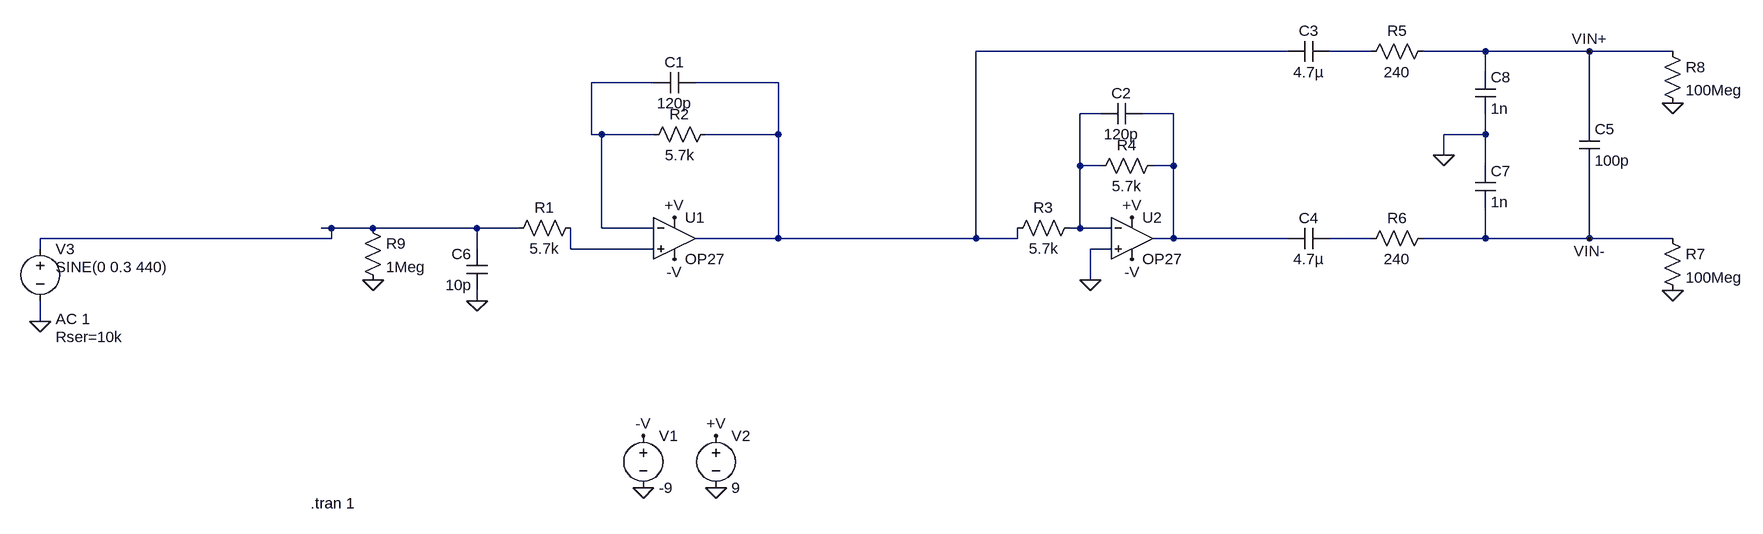
[diagram p0: schematic Draft1.asc]
Draft1.asc, the LTspice schematic file:
Version 4
SHEET 1 2212 920
WIRE 1504 208 1024 208
WIRE 1632 208 1568 208
WIRE 1808 208 1712 208
WIRE 1968 208 1808 208
WIRE 2096 208 1968 208
WIRE 1808 240 1808 208
WIRE 528 256 432 256
WIRE 720 256 592 256
WIRE 1216 304 1184 304
WIRE 1328 304 1280 304
WIRE 1968 320 1968 208
WIRE 432 336 432 256
WIRE 448 336 432 336
WIRE 528 336 448 336
WIRE 720 336 720 256
WIRE 720 336 608 336
WIRE 1808 336 1808 304
WIRE 1808 336 1744 336
WIRE 1744 368 1744 336
WIRE 1184 384 1184 304
WIRE 1216 384 1184 384
WIRE 1328 384 1328 304
WIRE 1328 384 1296 384
WIRE 1808 384 1808 336
WIRE 32 480 16 480
WIRE 96 480 32 480
WIRE 256 480 96 480
WIRE 320 480 256 480
WIRE 448 480 448 336
WIRE 528 480 448 480
WIRE 1184 480 1184 384
WIRE 1184 480 1168 480
WIRE 1232 480 1184 480
WIRE 32 496 32 480
WIRE 32 496 -416 496
WIRE 720 496 720 336
WIRE 720 496 592 496
WIRE 1024 496 1024 208
WIRE 1024 496 720 496
WIRE 1088 496 1088 480
WIRE 1088 496 1024 496
WIRE 1328 496 1328 384
WIRE 1328 496 1296 496
WIRE 1504 496 1328 496
WIRE 1632 496 1568 496
WIRE 1808 496 1808 448
WIRE 1808 496 1712 496
WIRE 1968 496 1968 384
WIRE 1968 496 1808 496
WIRE 2096 496 1968 496
WIRE -416 512 -416 496
WIRE 256 512 256 480
WIRE 400 512 400 480
WIRE 528 512 400 512
WIRE 1232 512 1200 512
WIRE 1200 560 1200 512
WIRE 256 592 256 576
WIRE -416 624 -416 592
FLAG 512 880 0
FLAG 624 880 0
FLAG 256 592 0
FLAG -416 624 0
FLAG 512 800 -V
FLAG 624 800 +V
FLAG 560 528 -V
FLAG 560 464 +V
FLAG 1264 464 +V
FLAG 1264 528 -V
FLAG 1200 560 0
FLAG 1744 368 0
FLAG 1968 208 VIN+
FLAG 1968 496 VIN-
FLAG 96 560 0
FLAG 2096 288 0
FLAG 2096 576 0
SYMBOL voltage 512 784 R0
WINDOW 123 0 0 Left 0
WINDOW 39 0 0 Left 0
SYMATTR InstName V1
SYMATTR Value -9
SYMBOL voltage 624 784 R0
WINDOW 123 0 0 Left 0
WINDOW 39 0 0 Left 0
SYMATTR InstName V2
SYMATTR Value 9
SYMBOL res 416 464 R90
WINDOW 0 0 56 VBottom 2
WINDOW 3 32 56 VTop 2
SYMATTR InstName R1
SYMATTR Value 5.7k
SYMBOL res 624 320 R90
WINDOW 0 0 56 VBottom 2
WINDOW 3 32 56 VTop 2
SYMATTR InstName R2
SYMATTR Value 5.7k
SYMBOL cap 592 240 R90
WINDOW 0 0 32 VBottom 2
WINDOW 3 32 32 VTop 2
SYMATTR InstName C1
SYMATTR Value 120p
SYMBOL voltage -416 496 R0
WINDOW 123 24 124 Left 2
WINDOW 39 24 152 Left 2
WINDOW 3 24 44 Left 2
SYMATTR Value2 AC 1
SYMATTR SpiceLine Rser=10k
SYMATTR InstName V3
SYMATTR Value SINE(0 0.3 440)
SYMBOL res 1184 464 R90
WINDOW 0 0 56 VBottom 2
WINDOW 3 32 56 VTop 2
SYMATTR InstName R3
SYMATTR Value 5.7k
SYMBOL res 1312 368 R90
WINDOW 0 0 56 VBottom 2
WINDOW 3 32 56 VTop 2
SYMATTR InstName R4
SYMATTR Value 5.7k
SYMBOL cap 1280 288 R90
WINDOW 0 0 32 VBottom 2
WINDOW 3 32 32 VTop 2
SYMATTR InstName C2
SYMATTR Value 120p
SYMBOL cap 1568 192 R90
WINDOW 0 0 32 VBottom 2
WINDOW 3 32 32 VTop 2
SYMATTR InstName C3
SYMATTR Value 4.7µ
SYMBOL res 1728 192 R90
WINDOW 0 0 56 VBottom 2
WINDOW 3 32 56 VTop 2
SYMATTR InstName R5
SYMATTR Value 240
SYMBOL cap 1568 480 R90
WINDOW 0 0 32 VBottom 2
WINDOW 3 32 32 VTop 2
SYMATTR InstName C4
SYMATTR Value 4.7µ
SYMBOL res 1728 480 R90
WINDOW 0 0 56 VBottom 2
WINDOW 3 32 56 VTop 2
SYMATTR InstName R6
SYMATTR Value 240
SYMBOL cap 1952 320 R0
SYMATTR InstName C5
SYMATTR Value 100p
SYMBOL OpAmps\\OP27 560 432 R0
SYMATTR InstName U1
SYMBOL OpAmps\\OP27 1264 432 R0
SYMATTR InstName U2
SYMBOL cap 272 576 R180
WINDOW 0 24 56 Left 2
WINDOW 3 24 8 Left 2
SYMATTR InstName C6
SYMATTR Value 10p
SYMBOL res 2080 480 R0
SYMATTR InstName R7
SYMATTR Value 100Meg
SYMBOL res 2080 192 R0
SYMATTR InstName R8
SYMATTR Value 100Meg
SYMBOL res 80 464 R0
SYMATTR InstName R9
SYMATTR Value 1Meg
SYMBOL cap 1792 384 R0
SYMATTR InstName C7
SYMATTR Value 1n
SYMBOL cap 1792 240 R0
SYMATTR InstName C8
SYMATTR Value 1n
TEXT 0 904 Left 2 !.tran 1

The netlist it stands for:
* Draft1.asc
V1 -V 0 -9
V2 +V 0 9
R1 N008 N006 5.7k
R2 N001 N003 5.7k
C1 N001 N003 120p
V3 N006 0 SINE(0 0.3 440) AC 1 Rser=10k
R3 N004 N001 5.7k
R4 N005 N004 5.7k
C2 N005 N004 120p
C3 N002 N001 4.7µ
R5 VIN+ N002 240
C4 N007 N005 4.7µ
R6 VIN- N007 240
C5 VIN+ VIN- 100p
XU1 N008 N003 +V -V N001 OP27  ; pins In+ In- V+ V- OUT
XU2 0 N004 +V -V N005 OP27  ; pins In+ In- V+ V- OUT
C6 0 N006 10p
R7 VIN- 0 100Meg
R8 VIN+ 0 100Meg
R9 N006 0 1Meg
C7 0 VIN- 1n
C8 VIN+ 0 1n
.tran 1
.lib ADI.lib
.backanno
.end